# EAGLE design DCDCFinalBoardLayout (EAGLE 9.1.1)
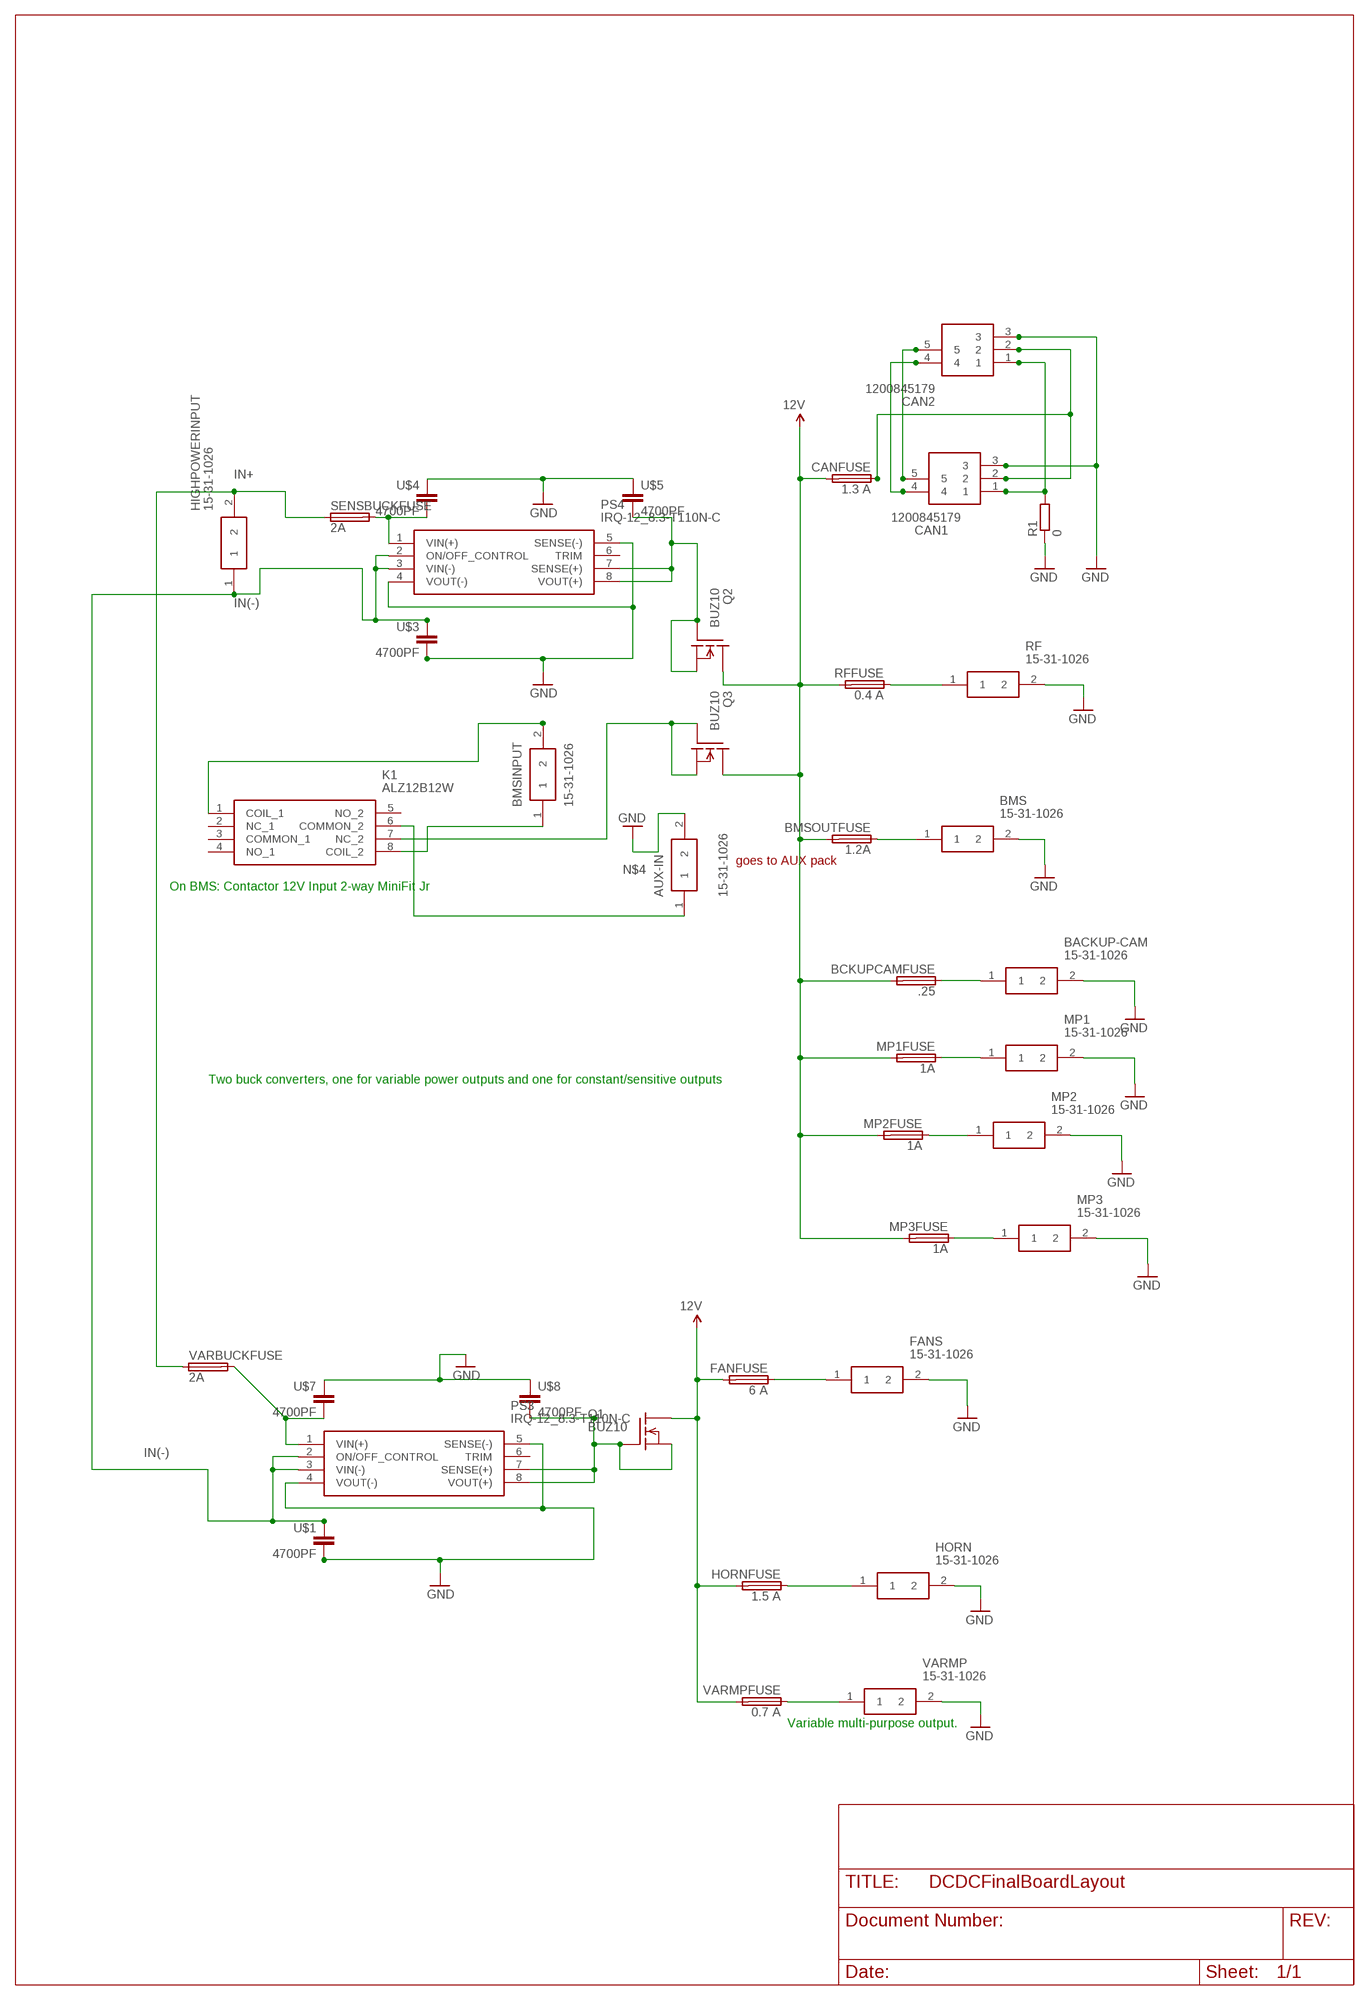
[diagram p0: schematic, sheet 1]

## Parts
AUX-IN  15-31-1026  [15311026]
BACKUP-CAM  15-31-1026  [15311026]
BCKUPCAMFUSE  .25  SMD-MICRO-FUSE-BLOCK  [OMNIBLOK]
BMS  15-31-1026  [15311026]
BMSINPUT  15-31-1026  [15311026]
BMSOUTFUSE  1.2A  SMD-MICRO-FUSE-BLOCK  [OMNIBLOK]
CAN1  1200845179  [1200845179]
CAN2  1200845179  [1200845179]
CANFUSE  1.3 A  SMD-MICRO-FUSE-BLOCK  [OMNIBLOK]
FANFUSE  6 A  SMD-MICRO-FUSE-BLOCK  [OMNIBLOK]
FANS  15-31-1026  [15311026]
HIGHPOWERINPUT  15-31-1026  [15311026]
HORN  15-31-1026  [15311026]
HORNFUSE  1.5 A  SMD-MICRO-FUSE-BLOCK  [OMNIBLOK]
K1  ALZ12B12W  [ALZ12B12W]
MP1  15-31-1026  [15311026]
MP1FUSE  1A  SMD-MICRO-FUSE-BLOCK  [OMNIBLOK]
MP2  15-31-1026  [15311026]
MP2FUSE  1A  SMD-MICRO-FUSE-BLOCK  [OMNIBLOK]
MP3  15-31-1026  [15311026]
MP3FUSE  1A  SMD-MICRO-FUSE-BLOCK  [OMNIBLOK]
PS3  IRQ-12_8.3-T110N-C  [IRQ1283T110NC]
PS4  IRQ-12_8.3-T110N-C  [IRQ1283T110NC]
Q1  BUZ10  [TO220]
Q2  BUZ10  [TO220]
Q3  BUZ10  [TO220]
R1  0  R  [R0805]
RF  15-31-1026  [15311026]
RFFUSE  0.4 A  SMD-MICRO-FUSE-BLOCK  [OMNIBLOK]
SENSBUCKFUSE  2A  SMD-MICRO-FUSE-BLOCK  [OMNIBLOK]
U$1  4700PF  [Y2_CAP]
U$3  4700PF  [Y2_CAP]
U$4  4700PF  [Y2_CAP]
U$5  4700PF  [Y2_CAP]
U$7  4700PF  [Y2_CAP]
U$8  4700PF  [Y2_CAP]
VARBUCKFUSE  2A  SMD-MICRO-FUSE-BLOCK  [OMNIBLOK]
VARMP  15-31-1026  [15311026]
VARMPFUSE  0.7 A  SMD-MICRO-FUSE-BLOCK  [OMNIBLOK]

## Nets
12V: BCKUPCAMFUSE.P$2 BMSOUTFUSE.P$2 CANFUSE.P$2 FANFUSE.P$2 HORNFUSE.P$2 MP1FUSE.P$2 MP2FUSE.P$2 MP3FUSE.P$2 Q1.2(D) Q2.2(D) Q3.2(D) RFFUSE.P$2 VARMPFUSE.P$2
CAN+: BACKUP-CAM.1 BCKUPCAMFUSE.P$1
GND: AUX-IN.2 BACKUP-CAM.2 BMS.2 CAN1.3 CAN2.3 FANS.2 HORN.2 MP1.2 MP2.2 MP3.2 PS3.4(VOUT(-)) PS3.5(SENSE(-)) PS4.4(VOUT(-)) PS4.5(SENSE(-)) R1.1 RF.2 U$1.P$2 U$3.P$2 U$4.P$1 U$5.P$1 U$7.P$1 U$8.P$1 VARMP.2
IN(-): HIGHPOWERINPUT.1 PS3.2(ON/OFF_CONTROL) PS3.3(VIN(-)) PS4.2(ON/OFF_CONTROL) PS4.3(VIN(-)) U$1.P$1 U$3.P$1
IN+: HIGHPOWERINPUT.2 SENSBUCKFUSE.P$1 VARBUCKFUSE.P$1
N$1: HORN.1 HORNFUSE.P$1
N$2: AUX-IN.1 K1.6(COMMON_2)
N$3: BMSINPUT.1 K1.8(COIL_2)
N$4: BMSINPUT.2 K1.1(COIL_1) K1.7(NC_2) Q3.1(G) Q3.3(S)
N$5: PS3.1(VIN(+)) U$7.P$2 VARBUCKFUSE.P$2
N$6: VARMP.1 VARMPFUSE.P$1
N$7: RF.1 RFFUSE.P$1
N$8: FANFUSE.P$1 FANS.1
N$9: PS4.1(VIN(+)) SENSBUCKFUSE.P$2 U$4.P$2
N$10: BMS.1 BMSOUTFUSE.P$1
N$11: MP2.1 MP2FUSE.P$1
N$12: MP3.1 MP3FUSE.P$1
N$13: PS3.7(SENSE(+)) PS3.8(VOUT(+)) Q1.1(G) Q1.3(S) U$8.P$2
N$14: MP1.1 MP1FUSE.P$1
N$15: PS4.7(SENSE(+)) PS4.8(VOUT(+)) Q2.1(G) Q2.3(S) U$5.P$2
N$17: CAN1.1 CAN2.1 R1.2
N$18: CAN1.4 CAN2.4
N$19: CAN1.5 CAN2.5
N$20: CAN1.2 CAN2.2 CANFUSE.P$1
Unconnected: K1.2(NC_1) K1.3(COMMON_1) K1.4(NO_1) K1.5(NO_2) PS3.6(TRIM) PS4.6(TRIM)

## Notes on the sheet
- goes to AUX pack
- On BMS: Contactor 12V Input 2-way MiniFit Jr
- Two buck converters, one for variable power outputs and one for constant/sensitive outputs
- Variable multi-purpose output.

## Library data of the parts
AUX-IN BACKUP-CAM BMS BMSINPUT FANS HIGHPOWERINPUT HORN MP1-MP3 RF VARMP = SamacSys_Parts:15-31-1026: Molex STANDARD .093 Series, Series Number 5025, 6.7mm Pitch 2 Way 1 Row Straight PCB Header, Solder Termination, 12A Source: Datasheet <https://componentsearchengine.com/Datasheets/1/15-31-1026.pdf>; DESCRIPTION: Molex STANDARD .093 Series, Series Number 5025, 6.7mm Pitch 2 Way 1 Row Straight PCB Header, Solder Termination, 12A; HEIGHT: 15mm; MANUFACTURER_NAME: Molex; MANUFACTURER_PART_NUMBER: 15-31-1026; MOUSER_PART_NUMBER: 538-15-31-1026; MOUSER_PRICE-STOCK: https://www.mouser.com/Search/Refine.aspx?Keyword=538-15-31-1026
BCKUPCAMFUSE BMSOUTFUSE CANFUSE FANFUSE HORNFUSE MP1FUSE MP2FUSE MP3FUSE RFFUSE SENSBUCKFUSE VARBUCKFUSE VARMPFUSE = f-lf-omniblok-s:SMD-MICRO-FUSE
CAN1 CAN2 = SamacSys_Parts:1200845179: REC U12 5P AC FE M16 BM SOL SHD Source: Datasheet <https://componentsearchengine.com/Datasheets/1/1200845179.pdf>; DESCRIPTION: REC U12 5P AC FE M16 BM SOL SHD; HEIGHT: 24.8mm; MANUFACTURER_NAME: Molex; MANUFACTURER_PART_NUMBER: 1200845179; MOUSER_PART_NUMBER: 538-1200845179; MOUSER_PRICE-STOCK: https://www.mouser.com/Search/Refine.aspx?Keyword=538-1200845179
K1 = SamacSys_Parts:ALZ12B12W: Low profile: 15.7mm height 1a/1c 16A power relay Source: Datasheet <https://www3.panasonic.biz/ac/e_download/control/relay/power/catalog/mech_eng_lz.pdf?via=ok>; DESCRIPTION: Low profile: 15.7mm height 1a/1c 16A power relay; HEIGHT: 15.7mm; MANUFACTURER_NAME: Panasonic; MANUFACTURER_PART_NUMBER: ALZ12B12W
PS3 PS4 = SamacSys_Parts:IRQ-12_8.3-T110N-C: Isolated DC/DC Converters 12V/8.3A 57.6-160Vin Isolated 1/4Brick Source: Datasheet <https://componentsearchengine.com/Datasheets/1/IRQ-12_8.3-T110N-C.pdf>; DESCRIPTION: Isolated DC/DC Converters 12V/8.3A 57.6-160Vin Isolated 1/4Brick; HEIGHT: 13.2mm; MANUFACTURER_NAME: Murata Electronics; MANUFACTURER_PART_NUMBER: IRQ-12/8.3-T110N-C; MOUSER_PART_NUMBER: 580-IRQ-12/8.3T110NC; MOUSER_PRICE-STOCK: https://www.mouser.com/Search/Refine.aspx?Keyword=580-IRQ-12%2F8.3T110NC
Q1-Q3 = transistor-fet:BUZ10: N-Channel Enhancement MOSFET 50V; 20A; 0,080Ohm
R1 = eagle-ltspice:R: RESISTOR, European symbol; SPICEMODEL: NONE; SPICEPREFIX: R
U$1 U$3-U$5 U$7 U$8 = NUSOLAR_Custom:4700PF

## Board
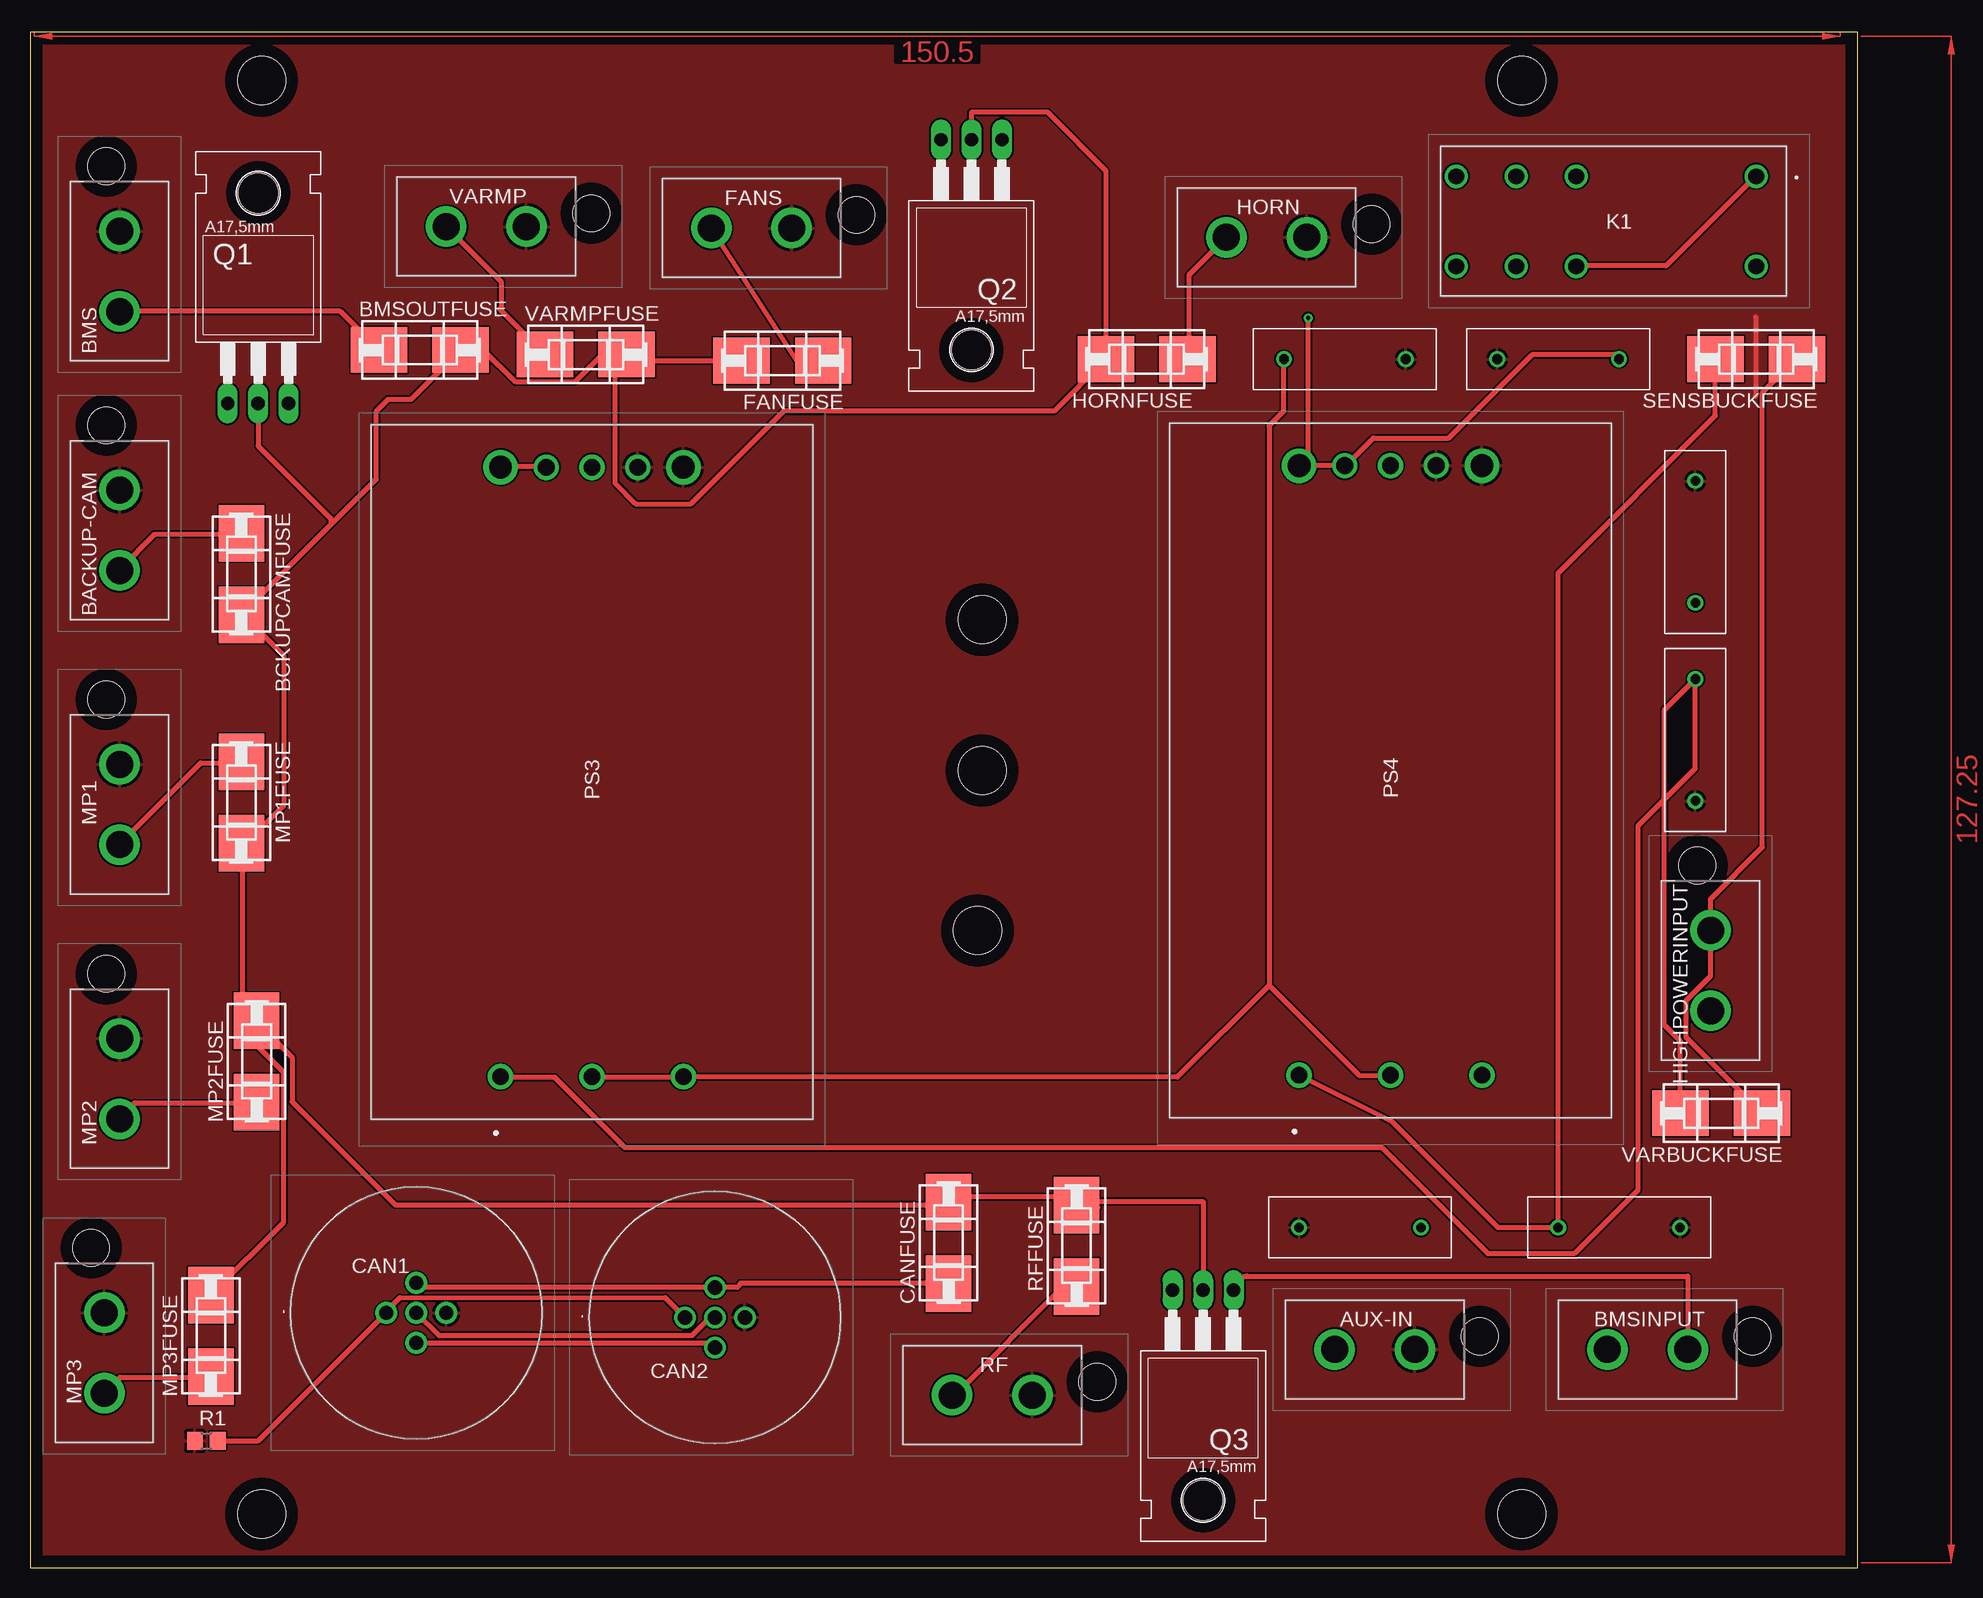
[diagram p1: board, top side]
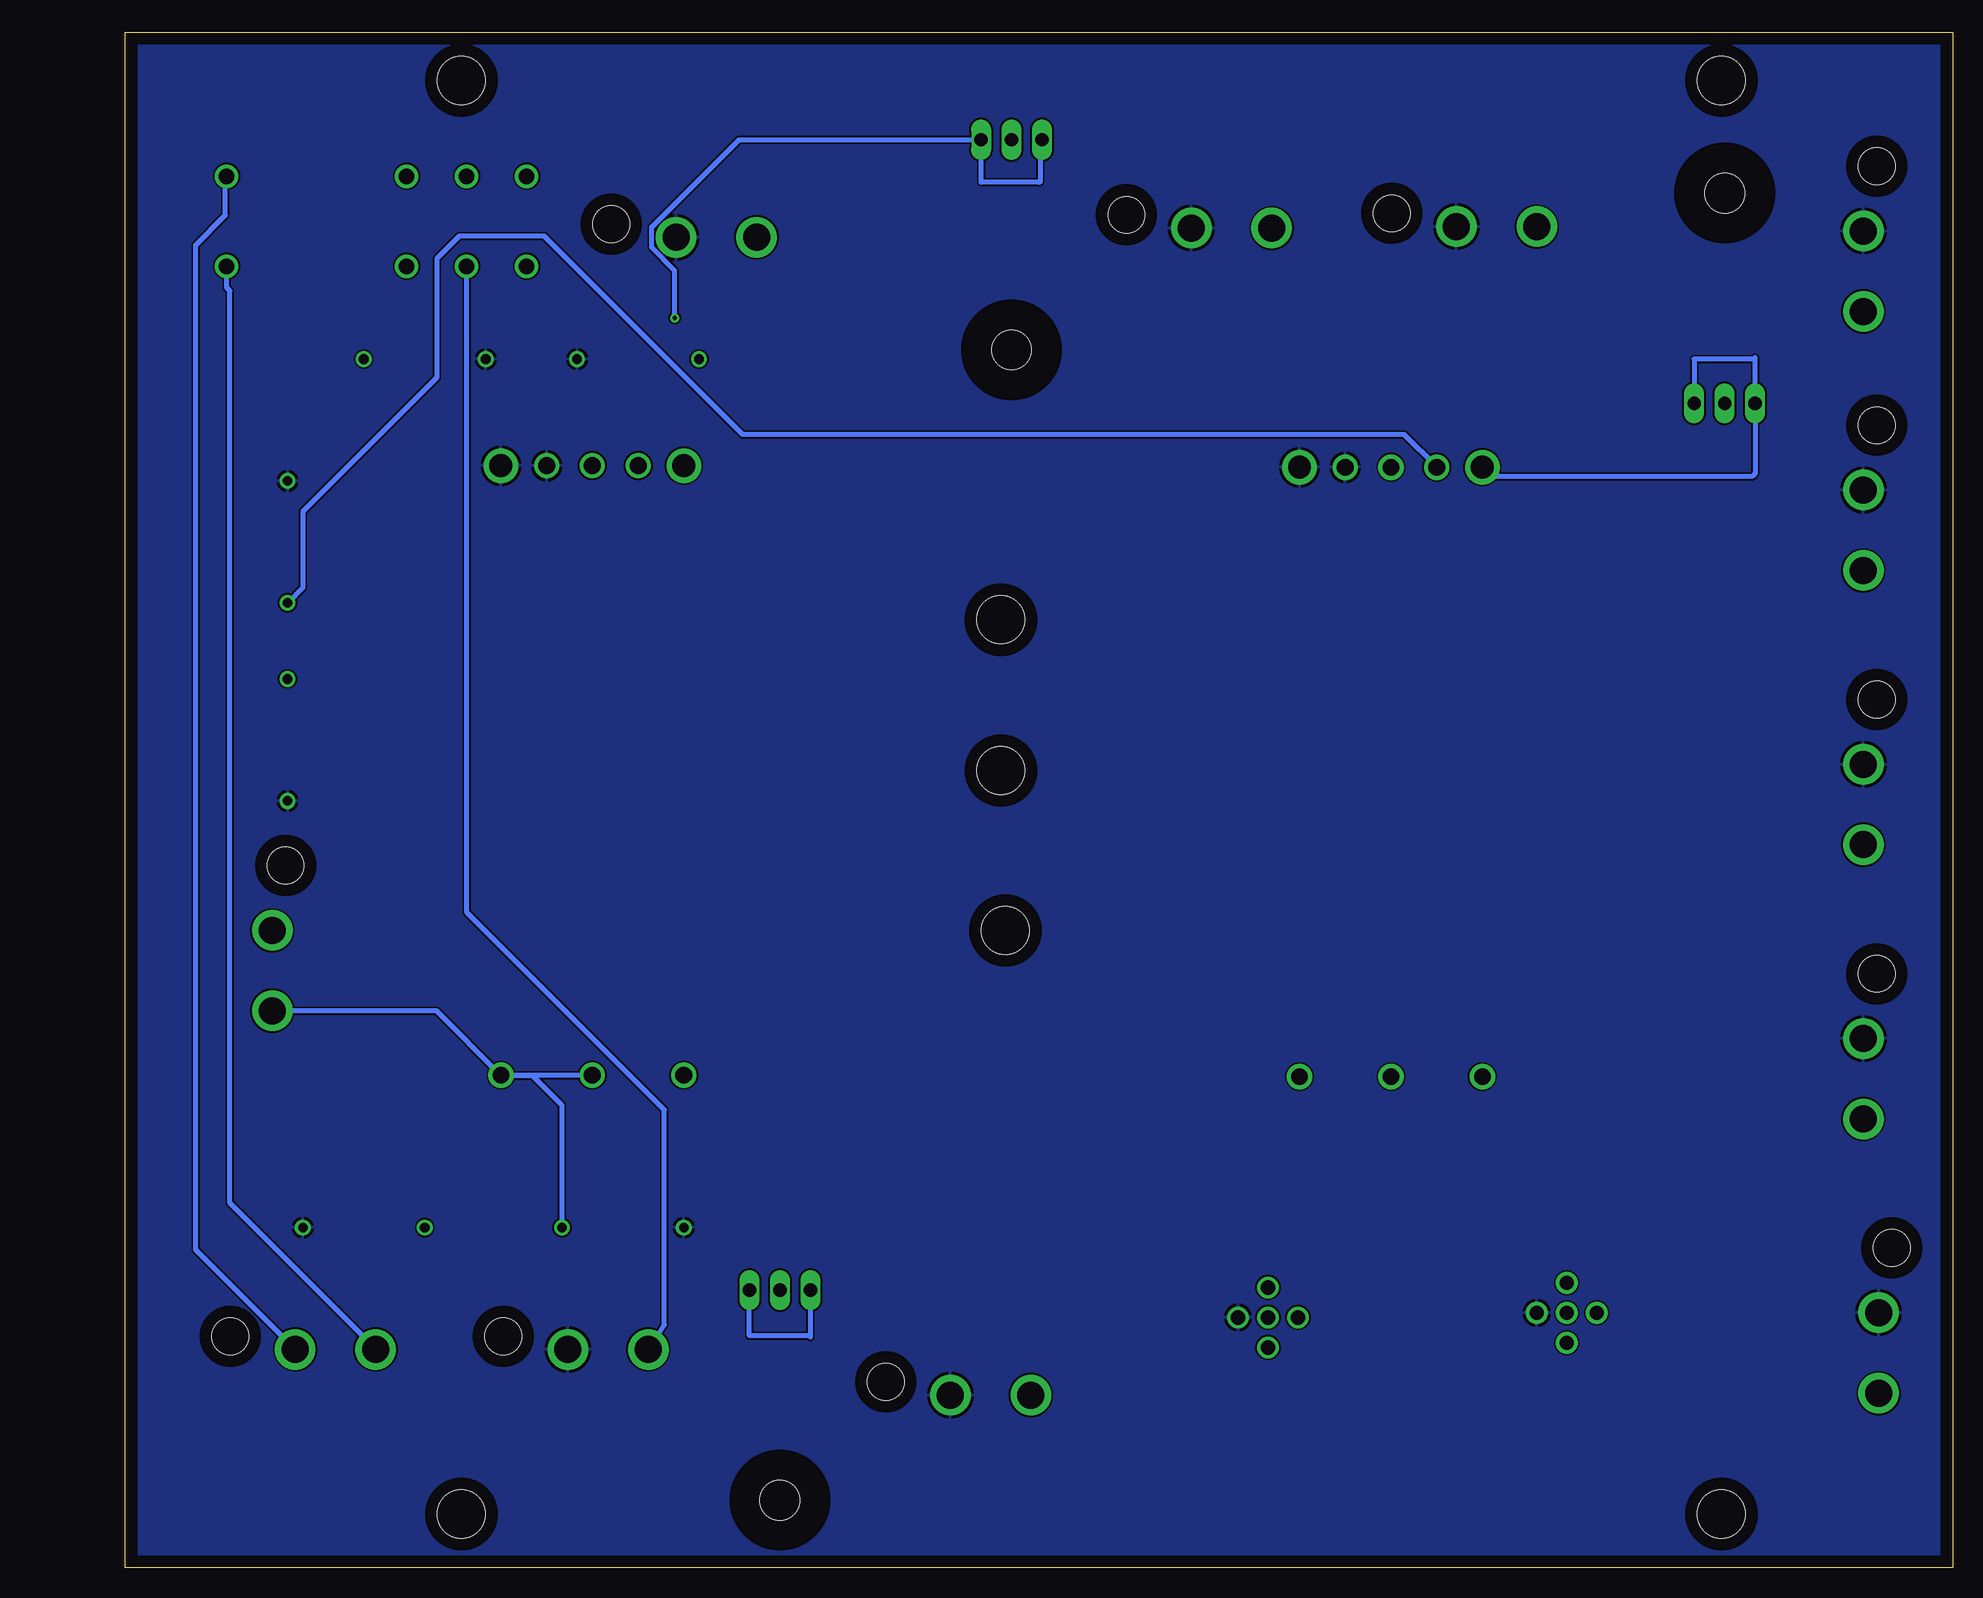
[diagram p2: board, bottom side, seen from below]

Size 152.3 x 128 mm. Coordinates in mm from the lower left corner, seen from the top.
Outline: 0,0 152.3,0 152.3,128 0,128 0,0
Copper layers (1*16): Top 0.035mm / dielectric 1.5mm / Bottom 0.035mm
Design rules "default": minimum track width 6mil, minimum drill 0.35mm, track to track 6mil, track to pad 6mil, pad to pad 6mil, via to via 6mil, smd to smd 6mil, copper to edge 40mil, drill to drill 6mil, minimum pad ring 10mil, minimum via ring 8mil, stop-mask expansion 4mil, vias tented up to drill 0mil, thermal gap 10mil
Holes 4 mm at 19.3,124 19.3,4.5 124.3,4.5 124.3,124 79.34,66.48 79.34,79.05 78.96,53.14

### Footprints (pad centres in the part's own frame; a part is rotated, then mirrored left to right if it is on the bottom)
15311026 = drill 2.25 pad 3.375: 1 4.1,0; 2 10.8,0 | hole 3.05: 16.2,1.1
OMNIBLOK = smd 4.7 x 3.8: P$1 -3.4,0; P$2 3.4,0
1200845179 = drill 1.2 pad 1.8: 1 0,0; 2 2.5,2.5; 3 5,0; 4 2.5,-2.5; 5 2.5,0
ALZ12B12W = drill 1.3 pad 1.95: 1 0,0; 2 15,0; 3 20,0; 4 25,0; 5 25,7.5; 6 20,7.5; 7 15,7.5; 8 0,7.5
IRQ1283T110NC = drill 1.4 pad 2.1: 1 0,0; 2 0,-7.62; 3 0,-15.24; 5 50.8,-11.43; 6 50.8,-7.62; 7 50.8,-3.81 | drill 1.91 pad 2.865: 4 50.8,-15.24; 8 50.8,0
TO220 = drill 1.118 long: 1 -2.54,-6.35; 2 0,-6.35; 3 2.54,-6.35 | hole 3.302: 0,11.176
R0805 = smd 1.3 x 1.5: 1 -0.95,0; 2 0.95,0
Y2_CAP = drill 0.8: P$1 0,0; P$2 10.16,0

### Placement (x,y rotation side)
AUX-IN  104.61,18.22 0 top
BACKUP-CAM  7.46,79.05 90 top
BCKUPCAMFUSE  17.62,82.86 270 top
BMS  7.46,100.64 90 top
BMSINPUT  127.35,18.22 0 top
BMSOUTFUSE  32.48,101.53 0 top
CAN1  29.68,21.27 0 top
CAN2  54.58,20.88 0 top
CANFUSE  76.55,27.11 90 top
FANFUSE  62.7,100.64 180 top
FANS  52.67,111.69 0 top
HIGHPOWERINPUT  140.05,42.35 90 top
HORN  95.6,110.93 0 top
HORNFUSE  93.06,100.77 180 top
K1  143.86,116.01 180 top
MP1  7.46,56.19 90 top
MP1FUSE  17.62,63.81 270 top
MP2  7.46,33.33 90 top
MP2FUSE  18.89,42.22 90 top
MP3  6.19,10.47 90 top
MP3FUSE  15.08,19.36 90 top
PS3  39.21,40.95 90 top
PS4  105.76,41.08 90 top
Q1  19.02,103.43 0 top
Q2  78.45,112.71 180 top
Q3  97.76,16.82 180 top
R1  14.7,10.6 0 top
RF  72.74,14.41 0 top
RFFUSE  87.22,26.85 90 top
SENSBUCKFUSE  143.86,100.77 180 top
U$1  115.92,28.38 180 top
U$3  104.49,100.77 0 top
U$4  137.51,28.38 180 top
U$5  122.27,100.77 0 top
U$7  138.78,63.94 90 top
U$8  138.78,90.61 270 top
VARBUCKFUSE  140.94,37.9 180 top
VARMP  30.57,111.82 0 top
VARMPFUSE  46.32,101.15 0 top

### Tracks (layer width: path | path; a pad name or v marks a point on that pad's centre or on a via)
12V
  Top 0.152: 87.12,30.16 86.45,30.16 | 87.12,30.16 87.34,30.16 | 87.34,30.16 87.31,30.16 RFFUSE.P$2 | 87.34,30.16 88.84,30.16 | 88.84,30.16 88.98,30.02 | RFFUSE.P$2 87.75,30.25 87.85,30.16 | RFFUSE.P$2 87.12,30.16 | RFFUSE.P$2 88.74,30.25 88.84,30.16 | 76.3,30.26 CANFUSE.P$2
  Top 0.4: 18.94,45.47 21.84,42.58 21.84,38.87 30.45,30.26 76.3,30.26 | 18.94,45.47 MP2FUSE.P$2 18.79,45.62 17.72,46.69 17.72,60.41 MP1FUSE.P$2 17.98,60.41 21.12,63.56 21.12,76.05 17.72,79.46 BCKUPCAMFUSE.P$2 17.72,79.61 25.07,86.96 28.87,90.76 28.87,96.45 29.84,97.41 | HORNFUSE.P$2 85.34,96.45 62.81,96.45 55.06,88.7 50.49,88.7 48.76,90.43 48.76,100.62 48.73,100.64 | VARMPFUSE.P$2 48.99,101.15 48.23,101.15 48.73,100.64 | 48.73,100.64 FANFUSE.P$2 | 86.45,30.16 87.34,30.16 87.85,30.16 88.84,30.16 88.98,30.02 | CANFUSE.P$2 76.96,30.92 85.69,30.92 86.45,30.16 | 18.94,45.47 18.94,43.52 21.14,41.32 21.14,28.82 MP3FUSE.P$2 | 84.93,121.21 arc90 84.8,121.34 78.45,121.34 Q2.2 | RFFUSE.P$2 arc-90 87.5,30.54 97.76,30.54 Q3.2
  Top 0.406: 84.93,121.21 89.66,116.49 HORNFUSE.P$2 | Q1.2 19.02,93.53 25.07,87.47 25.07,86.96 | 48.99,101.15 47.67,101.15 45.42,98.89 40.42,98.89 37.79,101.53 BMSOUTFUSE.P$2 31.76,97.41 29.84,97.41
CAN+
  Top 0.4: BCKUPCAMFUSE.P$1 17.57,86.16 10.41,86.16 7.51,83.27 BACKUP-CAM.1
GND
  Top 0.4: 50.64,91.8 PS3.5 | 54.45,91.8 PS3.4 | 114.55,100.77 U$3.P$2 | 143.81,104.3 143.81,97.67 | 122.32,100.77 U$5.P$1 | 7.36,89.82 BACKUP-CAM.2
  Bottom 0.4: 41.45,111.71 VARMP.2 41.35,111.84 | 138.78,90.56 U$8.P$1 | 122.17,100.77 U$5.P$1 | 7.51,89.97 BACKUP-CAM.2 | 7.51,111.31 BMS.2 | 6.29,21.39 MP3.2 | 7.51,44.1 MP2.2 7.51,44.25 | 7.51,66.96 MP1.2 | 115.41,18.25 AUX-IN.2
  pour Top: 0.35,127.69 152.62,127.69 152.62,0.44 151.73,-0.45 -0.92,-0.45 0.35,0.82
  pour Bottom: 0.22,127.94 0.22,-0.07 152.11,-0.07 152.37,0.18 152.37,126.55 150.84,128.07 0.35,128.07
IN(-)
  Top 0.4: PS3.2 46.83,40.9 54.45,40.9 PS3.3 55.34,40.95 55.36,40.92 95.62,40.92 103.27,48.57 | U$3.P$1 104.49,96.42 103.27,95.2 103.27,48.57 | 103.27,48.57 110.65,41.17 110.74,41.08 PS4.2
  Bottom 0.4: U$1.P$1 115.92,38.59 118.36,41.03 120.95,41.03 | 120.95,41.03 PS4.3 126.37,46.45 HIGHPOWERINPUT.1 | PS4.2 120.9,41.08 120.95,41.03
IN+
  Top 0.4: SENSBUCKFUSE.P$1 147.16,100.77 144.36,97.97 144.36,60.08 140.05,55.77 HIGHPOWERINPUT.2 140.05,49.33 138.01,47.29 138.01,44.23 VARBUCKFUSE.P$1
N$1
  Top 0.4: HORNFUSE.P$1 96.56,100.77 96.56,107.78 99.61,110.82 HORN.1
N$2
  Bottom 0.4: K1.6 123.84,108.39 123.84,54.64 107.38,38.18 107.38,20.28 AUX-IN.1
N$3
  Bottom 0.4: 143.58,30.43 131.46,18.32 BMSINPUT.1 | 143.81,108.39 K1.8
  Bottom 0.406: 143.58,30.43 143.58,106.46 143.86,106.74 143.86,108.34 143.81,108.39
N$4
  Top 0.4: K1.7 128.87,108.54 136.34,108.54 143.81,116.01 K1.1 | Q3.1 arc-90 101.44,24.31 138.14,24.31 arc-90 138.15,24.31 BMSINPUT.2
  Bottom 0.4: 146.45,26.6 146.45,110.27 143.96,112.76 143.96,116.01 K1.1 | Q3.3 95.22,19.23 arc-90 95.34,19.36 100.3,19.36 Q3.1
  Bottom 0.406: BMSINPUT.2 146.45,26.52 146.45,26.6
N$5
  Top 0.4: PS3.1 39.21,40.9 43.73,40.9 49.6,35.03 112.67,35.03 121.51,26.19 128.67,26.19 134,31.53 134,61.88 138.78,66.66 U$7.P$2 136.21,71.53 136.21,45.25 137.54,43.92 VARBUCKFUSE.P$2
N$6
  Top 0.4: VARMP.1 39.26,107.23 39.26,104.96 39.11,104.96 VARMPFUSE.P$1
N$7
  Top 0.4: RFFUSE.P$1 86.1,23.45 77.06,14.41 RF.1
N$8
  Top 0.4: FANFUSE.P$1 63.91,100.64 FANS.1
N$9
  Top 0.4: PS4.1 113.48,37.22 122.32,28.38 U$4.P$2 127.35,82.94 140.45,96.04 SENSBUCKFUSE.P$2
N$10
  Top 0.4: BMSOUTFUSE.P$1 25.85,104.75 7.51,104.75 BMS.1
N$11
  Top 0.4: MP2FUSE.P$1 18.79,38.77 8.73,38.77 7.51,37.55 MP2.1
N$12
  Top 0.4: MP3FUSE.P$1 14.98,15.91 7.51,15.91 6.29,14.69 MP3.1
N$13
  Top 0.4: PS3.8 39.21,91.8 43.02,91.8 PS3.7
  Bottom 0.4: PS3.7 43.02,91.8 45.71,94.49 100.86,94.49 117.39,111.03 124.45,111.03 126.33,109.15 126.33,99.24 137.51,88.07 137.51,81.72 U$8.P$2 | Q1.1 16.48,100.89 arc90 16.6,100.77 21.56,100.77 Q1.3
  Bottom 0.406: Q1.1 16.48,91.24 16.73,90.99 38.45,90.99 PS3.8
N$14
  Top 0.4: MP1FUSE.P$1 17.57,67.11 14.22,67.11 7.51,60.41 MP1.1
N$15  (via drill 0.35)
  Top 0.4: U$5.P$2 132.05,101.15 125.19,101.15 118.23,94.19 111.93,94.19 109.67,91.93 PS4.7 109.52,91.93 105.86,91.93 PS4.8
  Top 0.406: PS4.8 106.52,92.64 v106.52,104.2 106.52,104.32
  Bottom 0.4: 105.71,91.78 PS4.8 | 101.16,119.06 Q2.1 80.99,115.5 76.17,115.5 arc-90 76.04,115.63 76.04,118.93 arc90 Q2.3
  Bottom 0.406: v106.52,104.2 106.52,108.16 108.44,110.08 108.44,111.77 101.16,119.06
N$17
  Top 0.38: 30.83,22.52 52.94,22.52
  Top 0.4: R1.2 19.02,10.6 CAN1.1 29.68,21.38 30.83,22.52 | 52.94,22.52 CAN2.1
N$18
  Top 0.152: 56.7,18.77 CAN2.4
  Top 0.4: CAN1.4 56.7,18.77
N$19
  Top 0.4: CAN1.5 32.2,21.27 34.09,19.37 55.17,19.37 56.68,20.88 CAN2.5
N$20
  Top 0.152: 59.12,23.55 58.95,23.38 | 32.57,23.38 CAN1.2
  Top 0.4: CANFUSE.P$1 59.15,23.71 59.12,23.55 | 58.95,23.38 CAN2.2 32.57,23.38
(copper drawn outside any net)
  shapes: Top area x2